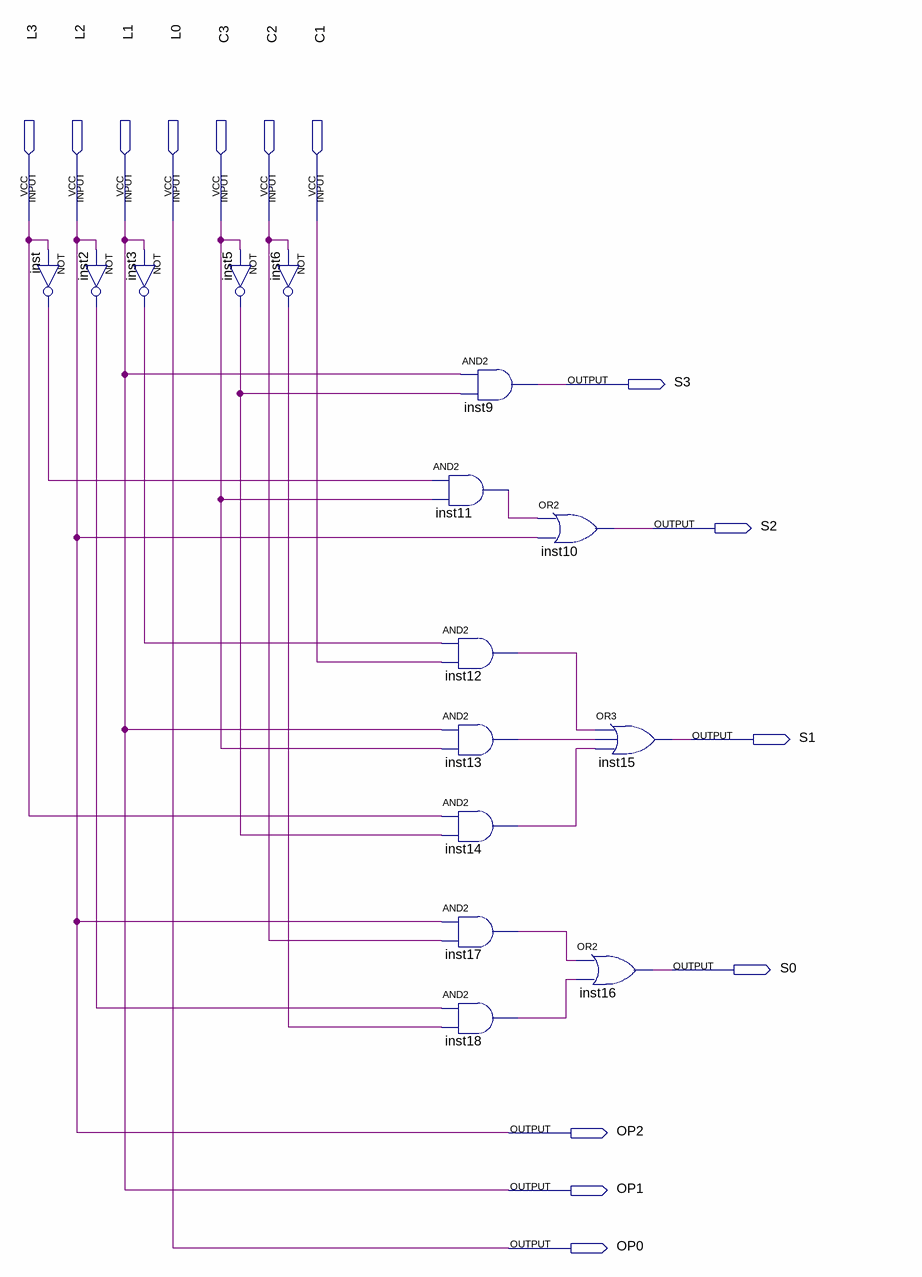
[diagram p0: schematic sheet]
// Quartus schematic DecodificadorEntrada.bdf as structural Verilog: 15 symbols, 14 pins
module DecodificadorEntrada (
  input  L3,
  input  L2,
  input  L1,
  input  L0,
  input  C3,
  input  C2,
  input  C1,
  output S3,
  output S2,
  output S1,
  output S0,
  output OP2,
  output OP1,
  output OP0
);

  wire inst2_out, inst3_out, inst5_out, inst6_out, inst11_out, inst12_out, inst13_out, inst14_out,
       inst17_out, inst18_out, inst_out;

  not inst (inst_out, L3);
  not inst2 (inst2_out, L2);
  not inst3 (inst3_out, L1);
  not inst5 (inst5_out, C3);
  not inst6 (inst6_out, C2);
  and inst9 (S3, L1, inst5_out);
  and inst11 (inst11_out, inst_out, C3);
  and inst12 (inst12_out, inst3_out, C1);
  and inst13 (inst13_out, L1, C3);
  and inst14 (inst14_out, L3, inst5_out);
  and inst17 (inst17_out, L2, C2);
  and inst18 (inst18_out, inst2_out, inst6_out);
  or inst10 (S2, inst11_out, L2);
  or inst15 (S1, inst12_out, inst13_out, inst14_out);
  or inst16 (S0, inst17_out, inst18_out);

  assign OP0 = L0;
  assign OP1 = L1;
  assign OP2 = L2;
endmodule
